# Altium schematic sheet TL061invertingamp.SchDoc
size A; SheetNumber: 1; SheetTotal: 1
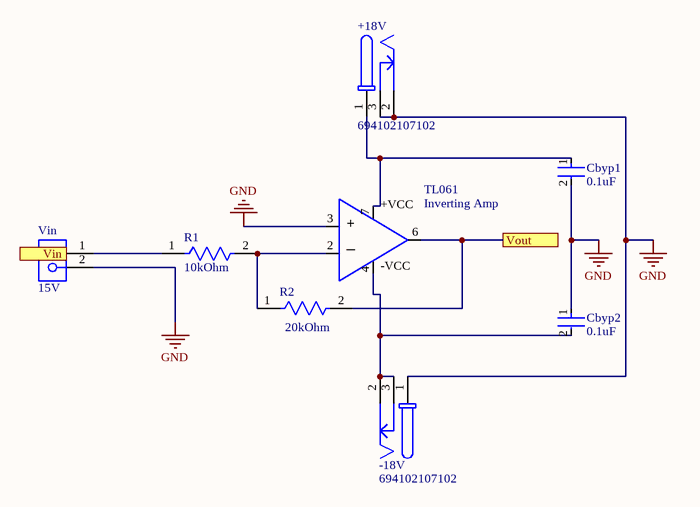
[diagram p0: TL061invertingamp.SchDoc]

## Parts
+18V  694102107102  [694102107102]
-18V  694102107102  [694102107102]
Cbyp1  0.1uF  [FP-CC0402-MFG]
Cbyp2  0.1uF  [FP-CC0402-MFG]
R1  10kOhm  [FP-MBB0207-MFG]
R2  20kOhm  [FP-MRS1600-MFG]
TL061  Inverting Amp  [TLC061ACD]
Vin  15V  [691408520002B]

## Ports
Vin, Vout

## Nets
GND: +18V.2 +18V.3 -18V.1 Cbyp1.2 Cbyp2.1 TL061.3 Vin.2
Vout: R2.2 TL061.6 ; port Vout
Net+18V_1: +18V.1 Cbyp1.1 TL061.7
Net-18V_2: -18V.2 -18V.3 Cbyp2.2 TL061.4
NetR1_1: R1.1 Vin.1
NetR1_2: R1.2 R2.1 TL061.2

## Notes on the sheet
- (in symbol TL061ACD) +VCC; +; _; -VCC

## Library data of the parts
+18V -18V = CMP-1502-00174-2: NexarPartId: 52645180; Connector Type: Power; Insulation Resistance: 100MΩ; Gender: Male; Current Rating: 5A; Voltage Rating: 18V; Shielding: Unshielded; Mount: Surface Mount; Packaging: Tape and Reel; Max Operating Temperature: 85°C; Color: Black; Contact Plating: Tin; Min Operating Temperature: -40°C; Housing Material: Polyamide; Termination: SMD/SMT; RoHS: Compliant; Contact Gender: Female; REACH SVHC: Unknown; Voltage Rating (DC): 18V; Operating Supply Voltage: 18V; Flammability Rating: UL94 V-0
Cbyp1 Cbyp2 = CMP-03422-000048-1: CAP CER 0.1UF 16V X7R 0402; Manufacturer: YAGEO; Manufacturer Part Number: CC0402KRX7R7BB104; Automotive Grade: NA; Capacitance: 100 nF; Temperature Coefficient: 30ppm/°C; Tolerance: 0.1; Value: 100 nF; Device Class L1: Passive Components; Material: Ceramic; Temperature Range Low: -55°C; Device Class L3: Ceramic Capacitors; Temperature Characteristic: X7R; Ipc Land Pattern Name: CAPC10050X50; Temperature Range High: +125°C; Voltage Rating: 16 V; Temperature: -55°C to +125°C; RoHS: TRUE; Automotive: No; Height: 0.55mm; Device Class L2: Capacitors; Digikey Description: CAP CER 0.1UF 16V X7R 0402; Package: CC0402; Footprint Url: http://www.yageo.com/exep/pages/download/literatures/UPY-C_GEN_24.pdf; ComponentLink2Description: Datasheet; Category: Cap; Lead Free: Yes; Octopart: https://octopart.com/cc0402krx7r7bb104-yageo-42244624; ComponentLink2URL: http://www.yageo.com/documents/recent/UPY-GP_NP0_16V-to-50V_16.pdf; Mouser Description: 0402 0.1 uF 16 V ±10 % Tolerance X7R SMT Multilayer Ceramic Capacitor
R1 = CMP-02408-000035-1: RES 10K OHM 0.6W 1% AXIAL; Voltage Rating: 300V; Resistance: 10kR; Max Power Dissipation: 600mW; Temperature Coefficient: 50ppm/°C; Radiation Hardening: No; Case/Package: Conformal; Termination: Axial; Military Standard: Not; Length: 6.5mm; Voltage Rating (DC): 300V; RoHS Compliant: Yes; Number of Terminations: 2; Packaging: Tape and Reel; Features: Automotive AEC-Q200; Tolerance: 1%; Min Operating Temperature: -55°C; Power Rating: 600mW; Lead Free: Lead Free; Resistor Type: Metal Film; Construction: Cylindrical; Series: MBB 0207 - Professional; Max Operating Temperature: 155°C; Diameter: 2.5mm; Resistance Tolerance: 1%; Contact Plating: Tin; Technology: THIN FILM
R2 = CMP-02408-000019-1: RES 20K OHM 0.4W 1% AXIAL; Max Power Dissipation: 400mW; Temperature Coefficient: 50ppm/°C; Resistance: 20kR; Technology: THIN FILM; Max Operating Temperature: 155°C; Number of Terminations: 2; RoHS Compliant: Yes; Packaging: Tape and Reel; Radiation Hardening: No; Contact Plating: Tin; Military Standard: Not; Construction: Cylindrical; Diameter: 1.6mm; Tolerance: 1%; Mount: Through Hole; Power Rating: 400mW; Case/Package: Conformal; Termination: Axial; Length: 3.6mm; Min Operating Temperature: -55°C; Resistor Type: Metal Film; Series: MRS16
TL061 = TL061ACD
Vin = CMP-03913-118042523-1: 691408520002B Terminal Block, Wtb, 2WAY, 28-12AWG;; Voltage Rating: 300V; Number of Contacts: 2; Current Rating: 15A; Max Operating Temperature: 105°C; Number of Rows: 2; Height: 13.8mm; NexarPartId: 118042523; Min Operating Temperature: -40°C; Contact Material: Nickel, Tin